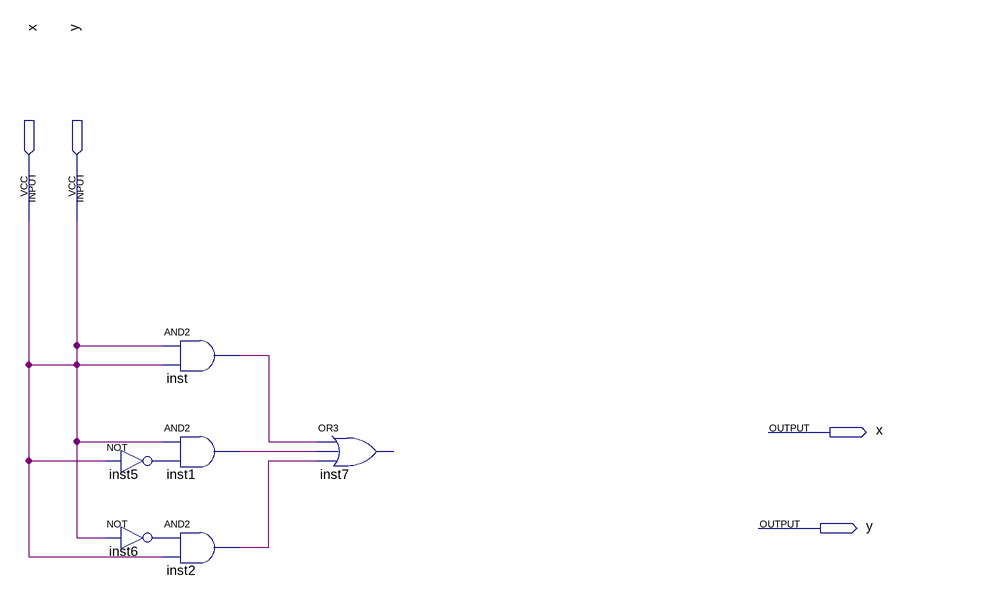
[diagram p0: schematic sheet]
// Quartus schematic display.bdf as structural Verilog: 6 symbols, 4 pins
module display (
  inout  x,
  inout  y
);

  wire inst1_out, inst2_out, inst5_out, inst6_out, inst_out;

  not inst5 (inst5_out, x);
  not inst6 (inst6_out, x);
  and inst (inst_out, x, x);
  and inst1 (inst1_out, x, inst5_out);
  and inst2 (inst2_out, inst6_out, x);
  // OR3 inst7 has open pins: IN1=inst_out, IN2=inst1_out, IN3=inst2_out, OUT=open

  assign y = x;
endmodule
